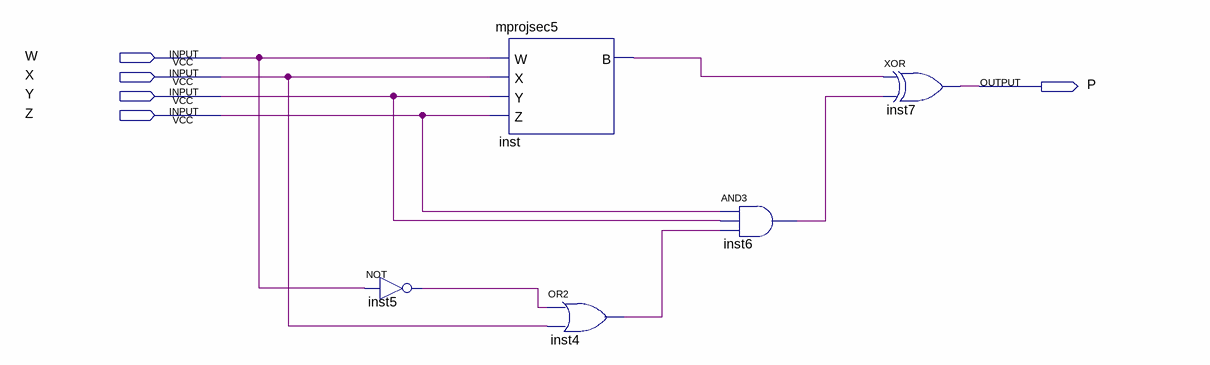
[diagram p0: schematic sheet]
// Quartus schematic mprojsec8.bdf as structural Verilog: 5 symbols, 5 pins
module mprojsec8 (
  input  W,
  input  X,
  input  Y,
  input  Z,
  output P
);

  wire inst4_out, inst5_out, inst6_out, inst_b;

  not inst5 (inst5_out, W);
  mprojsec5 inst (.W(W), .X(X), .Y(Y), .Z(Z), .B(inst_b));
  or inst4 (inst4_out, inst5_out, X);
  and inst6 (inst6_out, Z, Y, inst4_out);
  xor inst7 (P, inst_b, inst6_out);
endmodule
